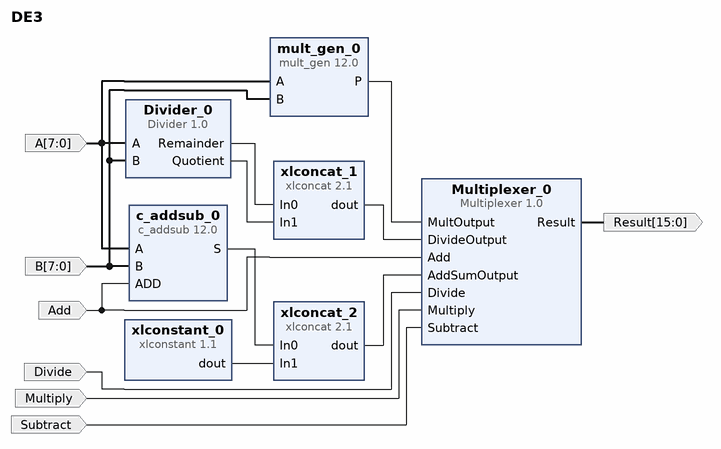
[diagram p0: block diagram of the top level]
# Vivado block design DE3, xc7a35tcpg236-1, Vivado 2019.2
create_bd_design DE3

create_bd_port -dir I Add
create_bd_port -dir I Subtract
create_bd_port -dir I Multiply
create_bd_port -dir I Divide
create_bd_port -dir I -from 7 -to 0 A
create_bd_port -dir I -from 7 -to 0 B
create_bd_port -dir O -from 15 -to 0 Result

create_bd_cell -type ip -vlnv xilinx.com:ip:c_addsub:12.0 c_addsub_0
set_property -dict [list \
  CONFIG.A_Type Unsigned \
  CONFIG.A_Width 8 \
  CONFIG.Add_Mode Add_Subtract \
  CONFIG.B_Type Unsigned \
  CONFIG.B_Value 00000000 \
  CONFIG.B_Width 8 \
  CONFIG.CE false \
  CONFIG.Latency 0 \
  CONFIG.Out_Width 8 \
] [get_bd_cells c_addsub_0]
create_bd_cell -type ip -vlnv xilinx.com:ip:mult_gen:12.0 mult_gen_0
set_property -dict [list \
  CONFIG.OutputWidthHigh 15 \
  CONFIG.PipeStages 0 \
  CONFIG.PortAType Unsigned \
  CONFIG.PortAWidth 8 \
  CONFIG.PortBType Unsigned \
  CONFIG.PortBWidth 8 \
  CONFIG.Use_Custom_Output_Width true \
] [get_bd_cells mult_gen_0]
create_bd_cell -type ip -vlnv xilinx.com:ip:xlconstant:1.1 xlconstant_0
set_property -dict {CONFIG.CONST_VAL 00000000 CONFIG.CONST_WIDTH 8} [get_bd_cells xlconstant_0]
create_bd_cell -type ip -vlnv xilinx.com:ip:xlconcat:2.1 xlconcat_1
set_property -dict {CONFIG.IN0_WIDTH 8 CONFIG.IN1_WIDTH 8} [get_bd_cells xlconcat_1]
create_bd_cell -type ip -vlnv xilinx.com:user:Divider:1.0 Divider_0
create_bd_cell -type ip -vlnv xilinx.com:ip:xlconcat:2.1 xlconcat_2
set_property -dict {CONFIG.IN0_WIDTH 8 CONFIG.IN1_WIDTH 8} [get_bd_cells xlconcat_2]
create_bd_cell -type ip -vlnv xilinx.com:user:Multiplexer:1.0 Multiplexer_0

# ---- connections ----

connect_bd_net [get_bd_pins Divider_0/Remainder] [get_bd_pins xlconcat_1/In0]
connect_bd_net [get_bd_pins Divider_0/Quotient] [get_bd_pins xlconcat_1/In1]
connect_bd_net [get_bd_ports Add] [get_bd_pins c_addsub_0/ADD] [get_bd_pins Multiplexer_0/Add]
connect_bd_net [get_bd_pins c_addsub_0/S] [get_bd_pins xlconcat_2/In0]
connect_bd_net [get_bd_pins xlconstant_0/dout] [get_bd_pins xlconcat_2/In1]
connect_bd_net [get_bd_ports A] [get_bd_pins c_addsub_0/A] [get_bd_pins mult_gen_0/A] [get_bd_pins Divider_0/A]
connect_bd_net [get_bd_ports B] [get_bd_pins c_addsub_0/B] [get_bd_pins mult_gen_0/B] [get_bd_pins Divider_0/B]
connect_bd_net [get_bd_pins Multiplexer_0/Result] [get_bd_ports Result]
connect_bd_net [get_bd_pins xlconcat_1/dout] [get_bd_pins Multiplexer_0/DivideOutput]
connect_bd_net [get_bd_pins mult_gen_0/P] [get_bd_pins Multiplexer_0/MultOutput]
connect_bd_net [get_bd_pins xlconcat_2/dout] [get_bd_pins Multiplexer_0/AddSumOutput]
connect_bd_net [get_bd_ports Divide] [get_bd_pins Multiplexer_0/Divide]
connect_bd_net [get_bd_ports Multiply] [get_bd_pins Multiplexer_0/Multiply]
connect_bd_net [get_bd_ports Subtract] [get_bd_pins Multiplexer_0/Subtract]

validate_bd_design
save_bd_design
